# Altium schematic sheet InputDig.SchDoc
size A4 portrait
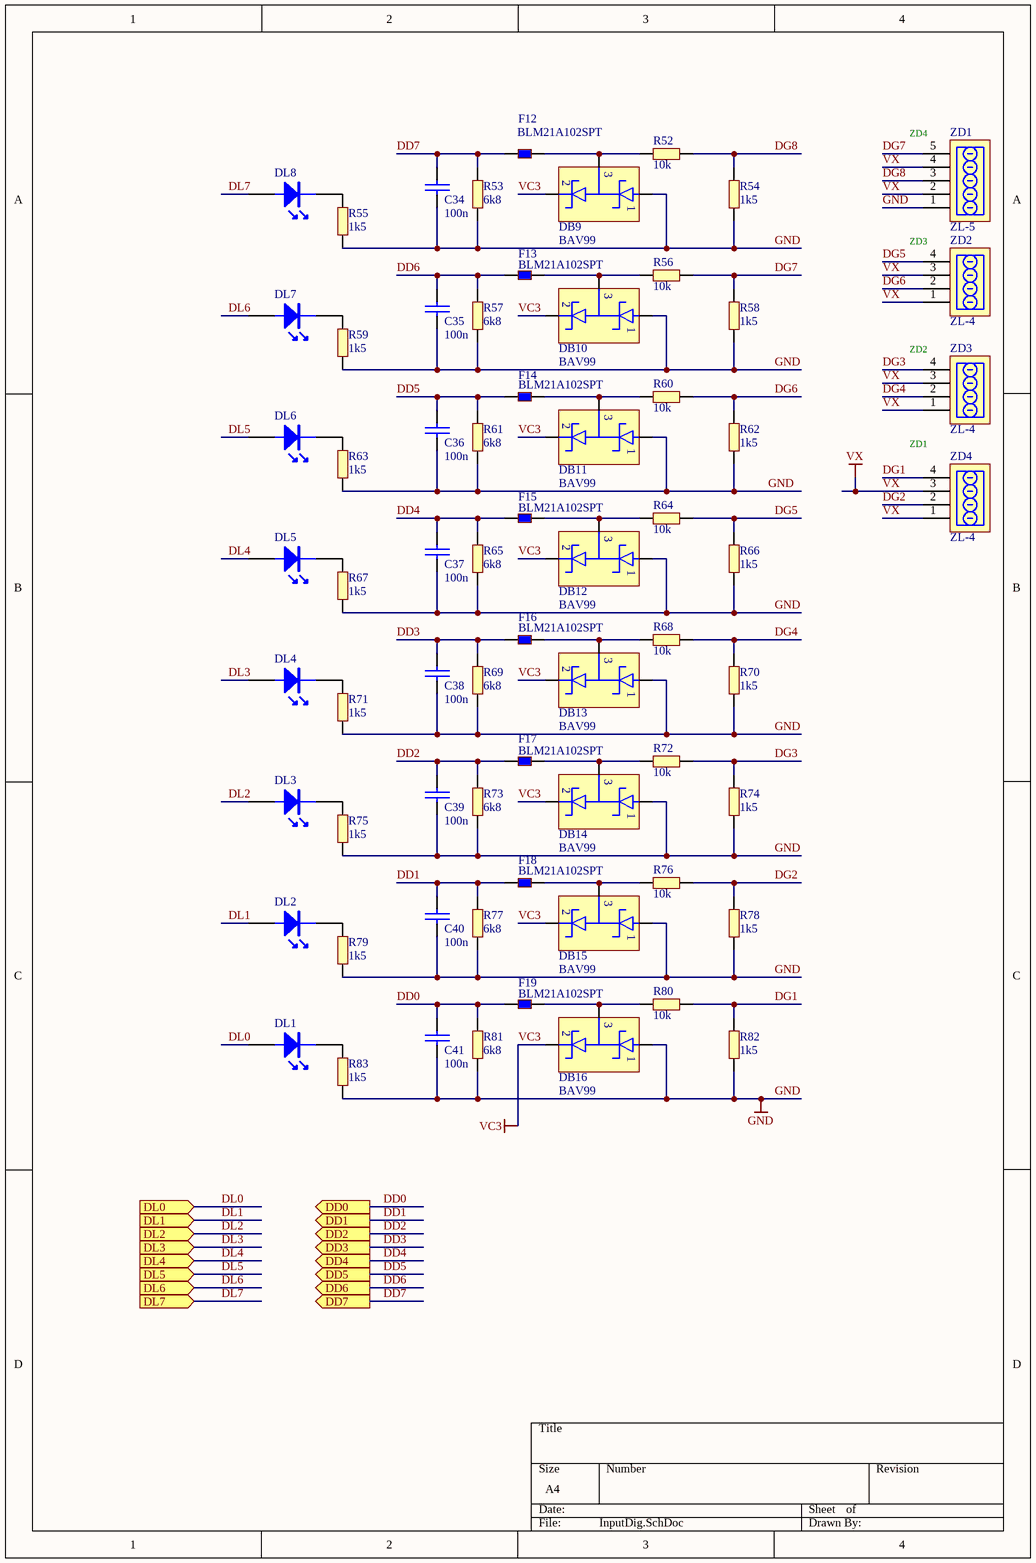
[diagram p0: InputDig.SchDoc]

## Parts
C34  100n  [0603C]
C35  100n  [0603C]
C36  100n  [0603C]
C37  100n  [0603C]
C38  100n  [0603C]
C39  100n  [0603C]
C40  100n  [0603C]
C41  100n  [0603C]
DB9  BAV99  [SOT-23]
DB10  BAV99  [SOT-23]
DB11  BAV99  [SOT-23]
DB12  BAV99  [SOT-23]
DB13  BAV99  [SOT-23]
DB14  BAV99  [SOT-23]
DB15  BAV99  [SOT-23]
DB16  BAV99  [SOT-23]
DL1  (no value)  [0603DR]
DL2  (no value)  [0603DR]
DL3  (no value)  [0603DR]
DL4  (no value)  [0603DR]
DL5  (no value)  [0603DR]
DL6  (no value)  [0603DR]
DL7  (no value)  [0603DR]
DL8  (no value)  [0603DR]
F12  BLM21A102SPT  [0603L]
F13  BLM21A102SPT  [0603L]
F14  BLM21A102SPT  [0603L]
F15  BLM21A102SPT  [0603L]
F16  BLM21A102SPT  [0603L]
F17  BLM21A102SPT  [0603L]
F18  BLM21A102SPT  [0603L]
F19  BLM21A102SPT  [0603L]
R52  10k  [0603R]
R53  6k8  [0603R]
R54  1k5  [0805R]
R55  1k5  [0603R]
R56  10k  [0603R]
R57  6k8  [0603R]
R58  1k5  [0805R]
R59  1k5  [0603R]
R60  10k  [0603R]
R61  6k8  [0603R]
R62  1k5  [0805R]
R63  1k5  [0603R]
R64  10k  [0603R]
R65  6k8  [0603R]
R66  1k5  [0805R]
R67  1k5  [0603R]
R68  10k  [0603R]
R69  6k8  [0603R]
R70  1k5  [0805R]
R71  1k5  [0603R]
R72  10k  [0603R]
R73  6k8  [0603R]
R74  1k5  [0805R]
R75  1k5  [0603R]
R76  10k  [0603R]
R77  6k8  [0603R]
R78  1k5  [0805R]
R79  1k5  [0603R]
R80  10k  [0603R]
R81  6k8  [0603R]
R82  1k5  [0805R]
R83  1k5  [0603R]
ZD1  ZL-5  [ARC-5-3.5-TYCO-2]
ZD2  ZL-4  [ARC-4-3.5-TYCO-2]
ZD3  ZL-4  [ARC-4-3.5-TYCO-2]
ZD4  ZL-4  [ARC-4-3.5-TYCO-2]

## Ports
DD0 (out), DD1 (out), DD2 (out), DD3 (out), DD4 (out), DD5 (out), DD6 (out), DD7 (out), DL0 (in), DL1 (in), DL2 (in), DL3 (in), DL4 (in), DL5 (in), DL6 (in), DL7 (in)

## Nets
GND: C34.2 C35.2 C36.2 C37.2 C38.2 C39.2 C40.2 C41.2 DB9.1 DB10.1 DB11.1 DB12.1 DB13.1 DB14.1 DB15.1 DB16.1 R53.2 R54.2 R55.2 R57.2 R58.2 R59.2 R61.2 R62.2 R63.2 R65.2 R66.2 R67.2 R69.2 R70.2 R71.2 R73.2 R74.2 R75.2 R77.2 R78.2 R79.2 R81.2 R82.2 R83.2 ZD1.1
VC3: DB9.2 DB10.2 DB11.2 DB12.2 DB13.2 DB14.2 DB15.2 DB16.2
VX: ZD1.2 ZD1.4 ZD2.1 ZD2.3 ZD3.1 ZD3.3 ZD4.1 ZD4.3
DD0: C41.1 F19.1 R81.1 ; port DD0
DD1: C40.1 F18.1 R77.1 ; port DD1
DD2: C39.1 F17.1 R73.1 ; port DD2
DD3: C38.1 F16.1 R69.1 ; port DD3
DD4: C37.1 F15.1 R65.1 ; port DD4
DD5: C36.1 F14.1 R61.1 ; port DD5
DD6: C35.1 F13.1 R57.1 ; port DD6
DD7: C34.1 F12.1 R53.1 ; port DD7
DG1: R80.1 R82.1 ZD4.4
DG2: R76.1 R78.1 ZD4.2
DG3: R72.1 R74.1 ZD3.4
DG4: R68.1 R70.1 ZD3.2
DG5: R64.1 R66.1 ZD2.4
DG6: R60.1 R62.1 ZD2.2
DG7: R56.1 R58.1 ZD1.5
DG8: R52.1 R54.1 ZD1.3
DL0: DL1.A ; port DL0
DL1: DL2.A ; port DL1
DL2: DL3.A ; port DL2
DL3: DL4.A ; port DL3
DL4: DL5.A ; port DL4
DL5: DL6.A ; port DL5
DL6: DL7.A ; port DL6
DL7: DL8.A ; port DL7
NetDB9_3: DB9.3 F12.2 R52.2
NetDB10_3: DB10.3 F13.2 R56.2
NetDB11_3: DB11.3 F14.2 R60.2
NetDB12_3: DB12.3 F15.2 R64.2
NetDB13_3: DB13.3 F16.2 R68.2
NetDB14_3: DB14.3 F17.2 R72.2
NetDB15_3: DB15.3 F18.2 R76.2
NetDB16_3: DB16.3 F19.2 R80.2
NetDL1_K: DL1.K R83.1
NetDL2_K: DL2.K R79.1
NetDL3_K: DL3.K R75.1
NetDL4_K: DL4.K R71.1
NetDL5_K: DL5.K R67.1
NetDL6_K: DL6.K R63.1
NetDL7_K: DL7.K R59.1
NetDL8_K: DL8.K R55.1

## Notes on the sheet
- (near ZD1) ZD4
- ZD3
- (near ZD3) ZD2
- ZD1

## Library data of the parts
C34-C41 = CAP: Capacitor
DB9-DB16 = BAS70-04
DL1-DL8 = LED
F12-F19 = KORALIK: Koralik ferrytowy
R52-R83 = RES3